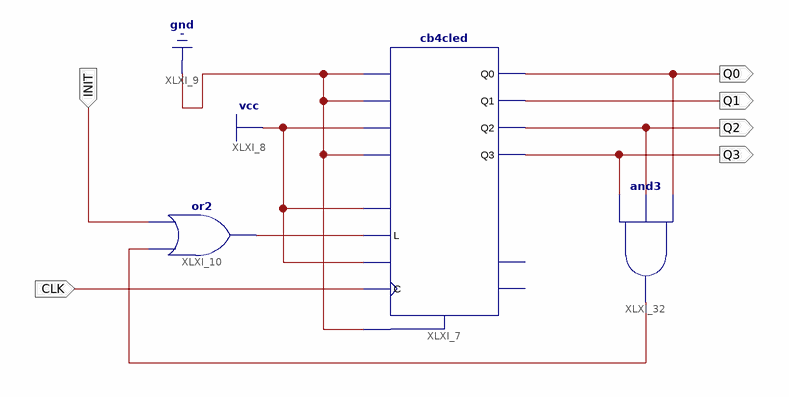
[diagram p0: schematic sheet 1]
// Xilinx ISE schematic p3ej2b.sch (spartan3) as structural Verilog: 3 symbols, 6 ports
module p3ej2b (
  input  INIT,
  input  CLK,
  output Q3,
  output Q2,
  output Q0,
  output Q1
);

  wire XLXN_23, XLXN_25;

  cb4cled XLXI_7 (
    .C(CLK), .CE(1'b1), .CLR(1'b0), .D0(1'b0), .D1(1'b0), .D2(1'b1), .D3(1'b0), .L(XLXN_23), .UP(1'b1),
    .Q0(Q0), .Q1(Q1), .Q2(Q2), .Q3(Q3));  // open: CEO, TC
  or XLXI_10 (XLXN_23, XLXN_25, INIT);
  and XLXI_32 (XLXN_25, Q3, Q2, Q0);
endmodule
